# EAGLE design mainbrd (EAGLE 5.06)
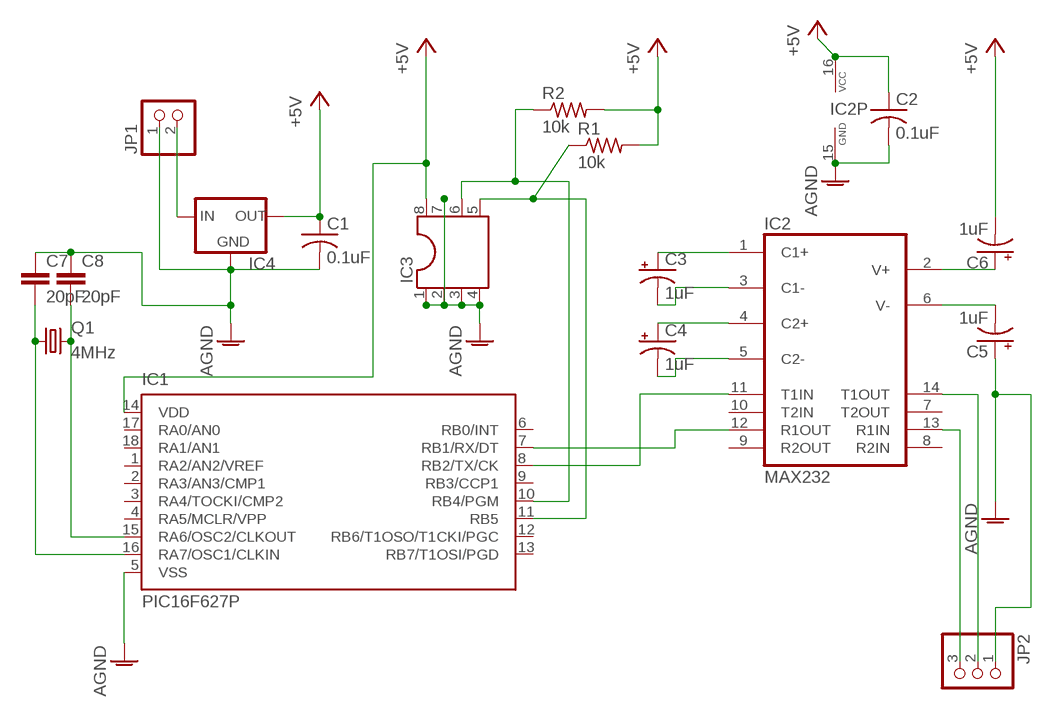
[diagram p0: schematic, sheet 1]

## Parts
C1  0.1uF  C-US050-025X075  [C050-025X075]
C2  0.1uF  C-US050-025X075  [C050-025X075]
C3  1uF  CPOL-USE2.5-5  [E2,5-5]
C4  1uF  CPOL-USE2.5-5  [E2,5-5]
C5  1uF  CPOL-USE2.5-5  [E2,5-5]
C6  1uF  CPOL-USE2.5-5  [E2,5-5]
C7  20pF  C2,5-3  [C2.5-3]
C8  20pF  C2,5-3  [C2.5-3]
IC1  PIC16F627P  [DIL18]
IC2  MAX232  [DIL16]
IC3  DIL8  [DIL08]
IC4  78XXL  [78XXL]
JP1  PINHD-1X2  [1X02]
JP2  PINHD-1X3  [1X03]
Q1  4MHz  CRYSTALHC49S  [HC49/S]
R1  10k  R-US_0204/7  [0204/7]
R2  10k  R-US_0204/7  [0204/7]

## Nets
+5V: C1.1 C2.1 C6.- IC1.14(VDD) IC2.16(VCC) IC3.8 IC4.OUT R1.2 R2.2
AGND: C1.2 C2.2 C5.+ C7.1 C8.1 IC1.5(VSS) IC2.15(GND) IC3.1 IC3.2 IC3.3 IC3.4 IC3.7 IC4.GND JP1.1 JP2.1
N$1: IC2.13(R1IN) JP2.3
N$2: IC1.11(RB5) IC3.5 R1.1
N$4: IC1.10(RB4/PGM) IC3.6 R2.1
N$6: IC1.8(RB2/TX/CK) IC2.11(T1IN)
N$7: IC1.7(RB1/RX/DT) IC2.12(R1OUT)
N$8: C3.+ IC2.1(C1+)
N$9: C3.- IC2.3(C1-)
N$10: C4.+ IC2.4(C2+)
N$11: C4.- IC2.5(C2-)
N$12: C5.- IC2.6(V-)
N$13: C6.+ IC2.2(V+)
N$14: IC2.14(T1OUT) JP2.2
N$15: C7.2 IC1.16(RA7/OSC1/CLKIN) Q1.1
N$16: IC4.IN JP1.2
N$17: C8.2 IC1.15(RA6/OSC2/CLKOUT) Q1.2
Unconnected: IC1.1(RA2/AN2/VREF) IC1.2(RA3/AN3/CMP1) IC1.3(RA4/TOCKI/CMP2) IC1.4(RA5/MCLR/VPP) IC1.6(RB0/INT) IC1.9(RB3/CCP1) IC1.12(RB6/T1OSO/T1CKI/PGC) IC1.13(RB7/T1OSI/PGD) IC1.17(RA0/AN0) IC1.18(RA1/AN1) IC2.7(T2OUT) IC2.8(R2IN) IC2.9(R2OUT) IC2.10(T2IN)

## Library data of the parts
C1 C2 = resistor:C-US: CAPACITOR, American symbol
C3-C6 = resistor:CPOL-US: POLARIZED CAPACITOR, American symbol
C7 C8 = capacitor-wima:C: CAPACITOR naming: grid - package width
IC1 = microchip:PIC16F62*: FLASH-Based 8-Bit CMOS Microcontroller Source: http://ww1.microchip.com/downloads/en/DeviceDoc/40300C.pdf
IC2 = maxim:MAX232: RS232 TRANSEIVER
IC3 = ic-package:DIL8: Dual In Line / Socket
IC4 = v-reg:78XXL: VOLTAGE REGULATOR
JP1 = pinhead:PINHD-1X2: PIN HEADER
JP2 = pinhead:PINHD-1X3: PIN HEADER
Q1 = crystal:CRYSTAL: CRYSTAL
R1 R2 = rcl:R-US_: RESISTOR, American symbol

## Board
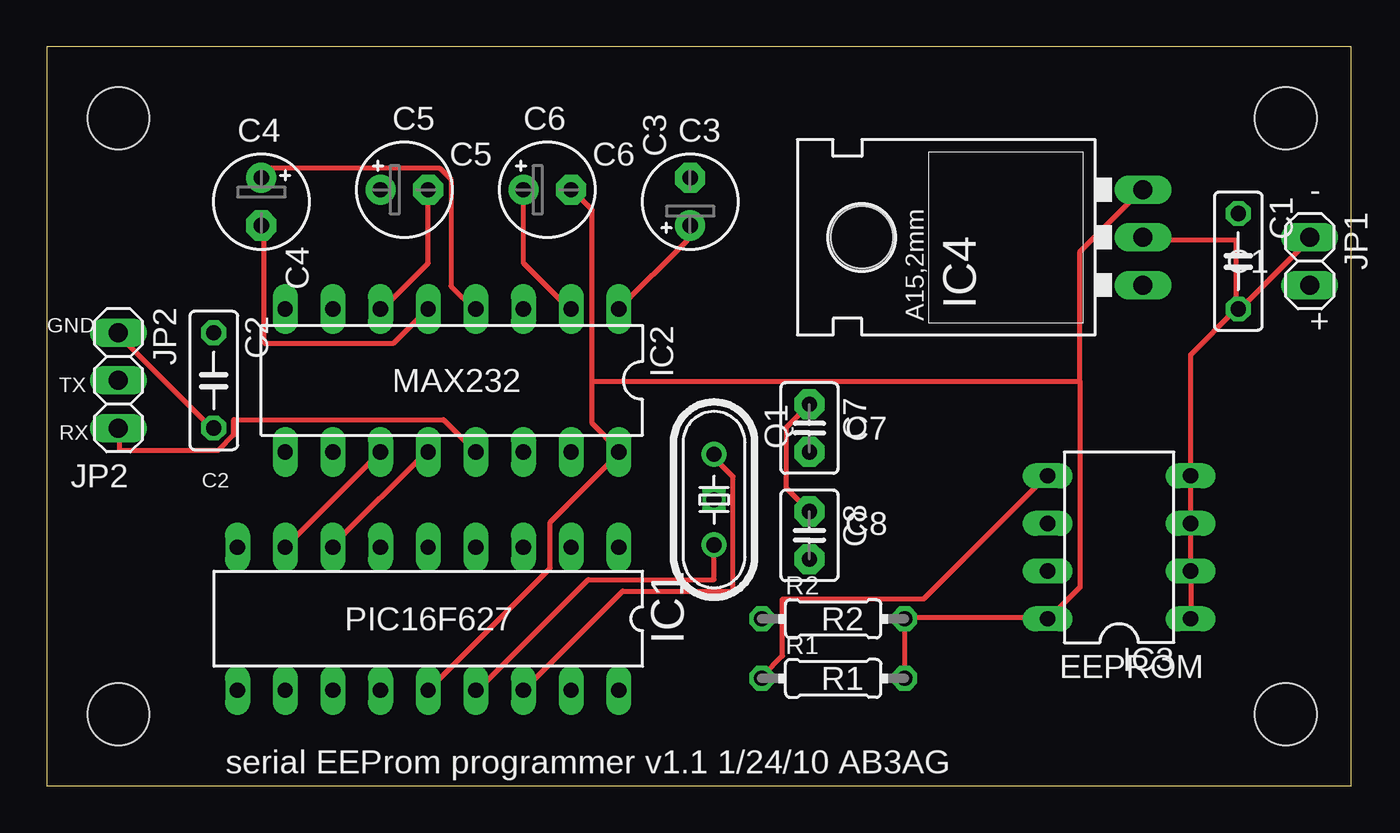
[diagram p1: board, top side]
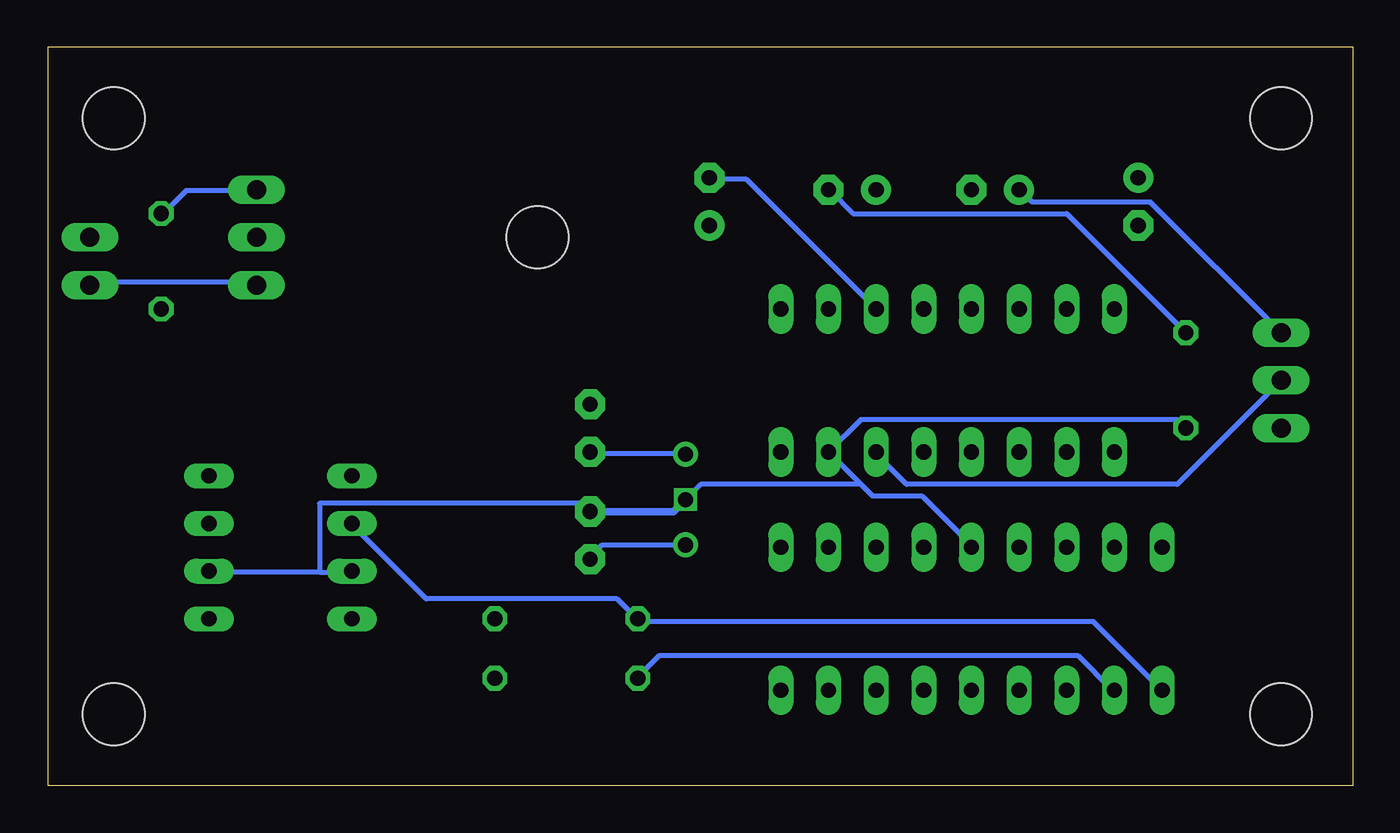
[diagram p2: board, bottom side, seen from below]

Size 69.52 x 39.36 mm. Coordinates in mm from the lower left corner, seen from the top.
Outline: 0,0 69.52,0 69.52,39.36 0,39.36 0,0
Copper layers (1*16): Top 0.035mm / dielectric 1.5mm / Bottom 0.035mm
Design rules "default": minimum track width 10mil, minimum drill 24mil, track to track 8mil, track to pad 8mil, pad to pad 8mil, via to via 8mil, smd to smd 8mil, copper to edge 40mil, drill to drill 8mil, minimum pad ring 10mil, minimum via ring 8mil, stop-mask expansion 4mil, vias tented up to drill 0mil, thermal gap 10mil

### Footprints (pad centres in the part's own frame; a part is rotated, then mirrored left to right if it is on the bottom)
C050-025X075 = drill 0.813 octagon: 1 -2.54,0; 2 2.54,0
E2,5-5 = drill 0.813 pad 1.6 round: + -1.27,0 | drill 0.813 pad 1.6 octagon: - 1.27,0
C2.5-3 = drill 0.813 pad 1.6 octagon: 1 -1.27,0; 2 1.27,0
DIL18 = drill 0.813 long: 1 -10.16,-3.81; 2 -7.62,-3.81; 3 -5.08,-3.81; 4 -2.54,-3.81; 5 0,-3.81; 6 2.54,-3.81; 7 5.08,-3.81; 8 7.62,-3.81; 9 10.16,-3.81; 10 10.16,3.81; 11 7.62,3.81; 12 5.08,3.81; 13 2.54,3.81; 14 0,3.81; 15 -2.54,3.81; 16 -5.08,3.81; 17 -7.62,3.81; 18 -10.16,3.81
DIL16 = drill 0.813 long: 1 -8.89,-3.81; 2 -6.35,-3.81; 3 -3.81,-3.81; 4 -1.27,-3.81; 5 1.27,-3.81; 6 3.81,-3.81; 7 6.35,-3.81; 8 8.89,-3.81; 9 8.89,3.81; 10 6.35,3.81; 11 3.81,3.81; 12 1.27,3.81; 13 -1.27,3.81; 14 -3.81,3.81; 15 -6.35,3.81; 16 -8.89,3.81
DIL08 = drill 0.813 long: 1 -3.81,-3.81; 2 -1.27,-3.81; 3 1.27,-3.81; 4 3.81,-3.81; 5 3.81,3.81; 6 1.27,3.81; 7 -1.27,3.81; 8 -3.81,3.81
78XXL = drill 1.016 long: GND 0,-3.81; IN -2.54,-3.81; OUT 2.54,-3.81 | hole 3.302: 0,11.176
1X02 = drill 1.016 long: 1 -1.27,0; 2 1.27,0
1X03 = drill 1.016 long: 1 -2.54,0; 2 0,0; 3 2.54,0
HC49/S = drill 0.813 round: 1 -2.413,0; 2 2.413,0
0204/7 = drill 0.813 octagon: 1 -3.81,0; 2 3.81,0
STAND-OFF = hole 3.302: 0,0

### Placement (x,y rotation side)
C1  63.5,27.94 270 top
C2  8.89,21.59 270 top
C3  34.29,31.11 90 top
C4  11.43,31.11 270 top
C5  19.05,31.75 0 top
C6  26.67,31.75 0 top
C7  40.64,19.05 270 top
C8  40.64,13.34 270 top
IC1  20.32,8.89 180 top
IC2  21.59,21.59 180 top
IC3  57.15,12.7 90 top
IC4  54.61,29.21 90 top
JP1  67.31,27.94 270 top
JP2  3.81,21.59 270 top
Q1  35.56,15.24 270 top
R1  41.91,5.71 0 top
R2  41.91,8.89 0 top
U$1  [STAND-OFF]  3.81,3.81 0 top
U$2  [STAND-OFF]  66.04,3.81 0 top
U$3  [STAND-OFF]  3.81,35.56 0 top
U$4  [STAND-OFF]  66.04,35.56 0 top

### Tracks (layer width: path | path; a pad name or v marks a point on that pad's centre or on a via)
+5V
  Top 0.254: R1.2 R2.2 45.72,8.94 53.24,8.94 IC3.8 53.44,8.94 55.07,10.57 55.07,21.54 | 55.07,21.54 55.07,28.45 58.32,31.7 IC4.OUT | IC1.14 26.82,11.58 26.82,14.02 30.48,17.68 IC2.16 30.48,17.88 29.06,19.3 29.06,21.54 | 29.06,21.54 29.06,30.68 28.04,31.7 C6.- | 29.06,21.54 55.07,21.54
  Bottom 0.254: C1.1 63.4,30.48 62.18,31.7 58.52,31.7 IC4.OUT | C2.1 15.24,30.48 26.62,30.48 27.84,31.7 C6.-
AGND  (via drill 0.8)
  Top 0.254: JP1.1 67.26,29.06 63.6,25.4 C1.2 63.4,25.4 | 63.4,25.4 63.4,29.06 58.52,29.06 IC4.GND | IC3.1 IC3.2 IC3.3 IC3.4 60.96,22.96 63.4,25.4 | C2.2 8.74,19.1 3.86,23.98 JP2.1 | C7.1 39.42,19.1 39.42,15.85 40.64,14.63 C8.1
  Bottom 0.254: 55.07,11.38 60.96,11.38 IC3.2 | 55.07,11.38 53.44,11.38 IC3.7 | C5.+ 17.68,31.7 17.07,31.09 10.77,31.09 JP2.1 | 26.21,16.05 25.6,15.44 22.96,15.44 20.32,12.8 IC1.5 | 26.21,16.05 IC2.15 26.21,19.51 9.35,19.51 C2.2 | v35.56,15.24 34.75,16.05 26.21,16.05 | 55.07,11.38 55.07,15.04 41.05,15.04 40.64,14.63 C8.1
  Bottom 0.406: v35.56,15.24 36.2,14.61 C8.1
N$1
  Top 0.254: IC2.13 21.13,19.51 9.96,19.51 9.96,18.69 9.14,17.88 3.86,17.88 3.86,18.9 JP2.3
N$2
  Top 0.254: IC3.5 53.24,16.46 46.74,9.96 39.22,9.96 39.22,6.91 38.2,5.89 R1.1
  Bottom 0.254: IC1.11 12.8,5.08 14.63,6.91 36.98,6.91 38,5.89 R1.1
N$4
  Bottom 0.254: IC1.10 13.82,8.74 38,8.74 R2.1 38.2,8.94 39.22,9.96 49.38,9.96 53.24,13.82 IC3.6
N$6
  Top 0.254: IC1.8 IC2.11
N$7
  Top 0.254: IC1.7 15.24,12.8 20.32,17.88 IC2.12
N$8
  Top 0.254: IC2.1 34.14,29.06 34.14,29.67 C3.+
N$9
  Bottom 0.254: IC2.3 32.31,32.31 34.14,32.31 C3.-
N$10
  Top 0.254: IC2.4 22.76,25.4 21.54,26.62 21.54,32.31 20.93,32.92 11.58,32.92 11.58,32.51 C4.+
N$11
  Top 0.254: IC2.5 18.49,23.57 11.58,23.57 11.58,29.67 C4.-
N$12
  Top 0.254: IC2.6 17.88,25.4 20.32,27.84 C5.-
N$13
  Top 0.254: IC2.2 27.84,25.4 25.4,27.84 C6.+
N$14
  Bottom 0.254: IC2.14 25.4,17.68 23.77,16.05 9.35,16.05 JP2.2
N$15
  Top 0.254: IC1.16 30.68,10.36 36.58,10.36 36.58,16.46 35.56,17.48 Q1.1
  Bottom 0.254: C7.2 40.64,17.68 35.56,17.68 Q1.1
N$16
  Bottom 0.254: IC4.IN 58.52,26.82 67.26,26.82 JP1.2
N$17
  Top 0.254: IC1.15 22.96,5.08 28.85,10.97 35.56,10.97 Q1.2
  Bottom 0.254: C8.2 40.64,12.19 40.03,12.8 35.56,12.8 Q1.2

### Text on the board
tPlace: C5 | C6 | C4 | C3 | - | C1 | GND | + | TX | MAX232 | RX | C7 | JP2 | C2 | C8 | PIC16F627 | R2 | EEPROM | R1 | serial EEProm programmer v1.1 1/24/10 AB3AG